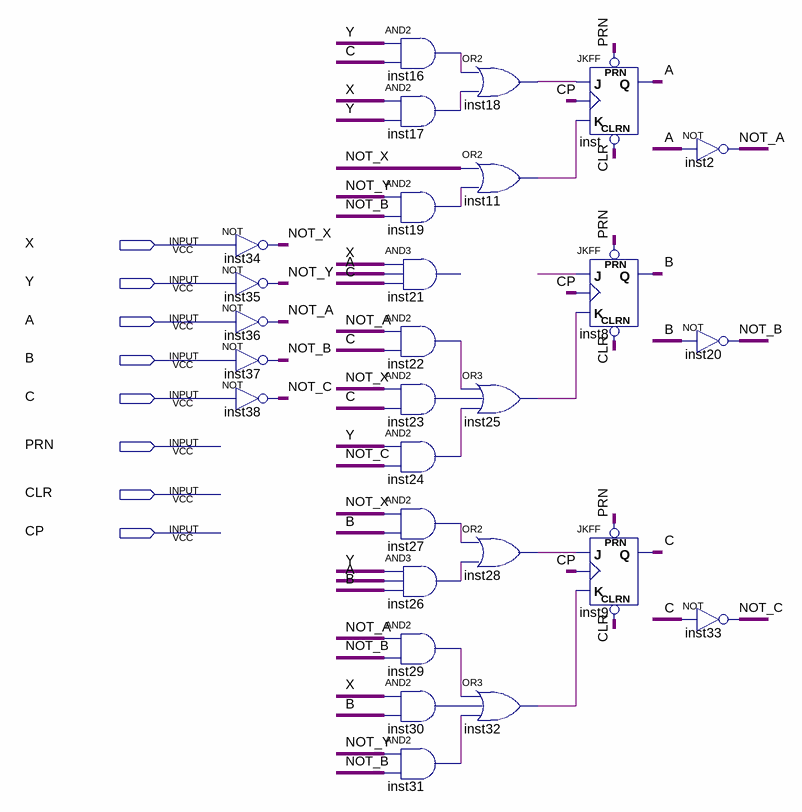
[diagram p0: schematic sheet]
// Quartus schematic PracticeProblem3.bdf as structural Verilog: 28 symbols, 8 pins
module PracticeProblem3 (
  input  X,
  input  Y,
  input  A,
  input  B,
  input  C,
  input  PRN,
  input  CLR,
  input  CP
);

  wire inst11_out, inst16_out, inst17_out, inst18_out, inst19_out, inst22_out, inst23_out, inst24_out,
       inst25_out, inst26_out, inst27_out, inst28_out, inst29_out, inst30_out, inst31_out, inst32_out, NOT_A,
       NOT_B, NOT_C, NOT_X, NOT_Y, undriven;

  not inst34 (NOT_X, X);
  not inst35 (NOT_Y, Y);
  not inst36 (NOT_A, A);
  not inst37 (NOT_B, B);
  not inst38 (NOT_C, C);
  and inst16 (inst16_out, Y, C);
  and inst17 (inst17_out, X, Y);
  and inst19 (inst19_out, NOT_Y, NOT_B);
  // AND3 inst21 has open pins: IN1=X, IN2=A, IN3=C, OUT=open
  and inst22 (inst22_out, NOT_A, C);
  and inst23 (inst23_out, NOT_X, C);
  and inst24 (inst24_out, Y, NOT_C);
  and inst27 (inst27_out, NOT_X, B);
  and inst26 (inst26_out, Y, A, B);
  and inst29 (inst29_out, NOT_A, NOT_B);
  and inst30 (inst30_out, X, B);
  and inst31 (inst31_out, NOT_Y, NOT_B);
  or inst18 (inst18_out, inst16_out, inst17_out);
  or inst11 (inst11_out, NOT_X, inst19_out);
  or inst25 (inst25_out, inst22_out, inst23_out, inst24_out);
  or inst28 (inst28_out, inst27_out, inst26_out);
  or inst32 (inst32_out, inst29_out, inst30_out, inst31_out);
  JKFF inst (.PRN(PRN), .CLRN(CLR), .K(inst11_out), .J(inst18_out), .CLK(CP), .Q(A));
  JKFF inst8 (.PRN(PRN), .CLRN(CLR), .K(inst25_out), .J(undriven), .CLK(CP), .Q(B));
  JKFF inst9 (.PRN(PRN), .CLRN(CLR), .K(inst32_out), .J(inst28_out), .CLK(CP), .Q(C));
  not inst2 (NOT_A, A);
  not inst20 (NOT_B, B);
  not inst33 (NOT_C, C);
endmodule
